# EAGLE design bluepod (EAGLE 9.5.2)
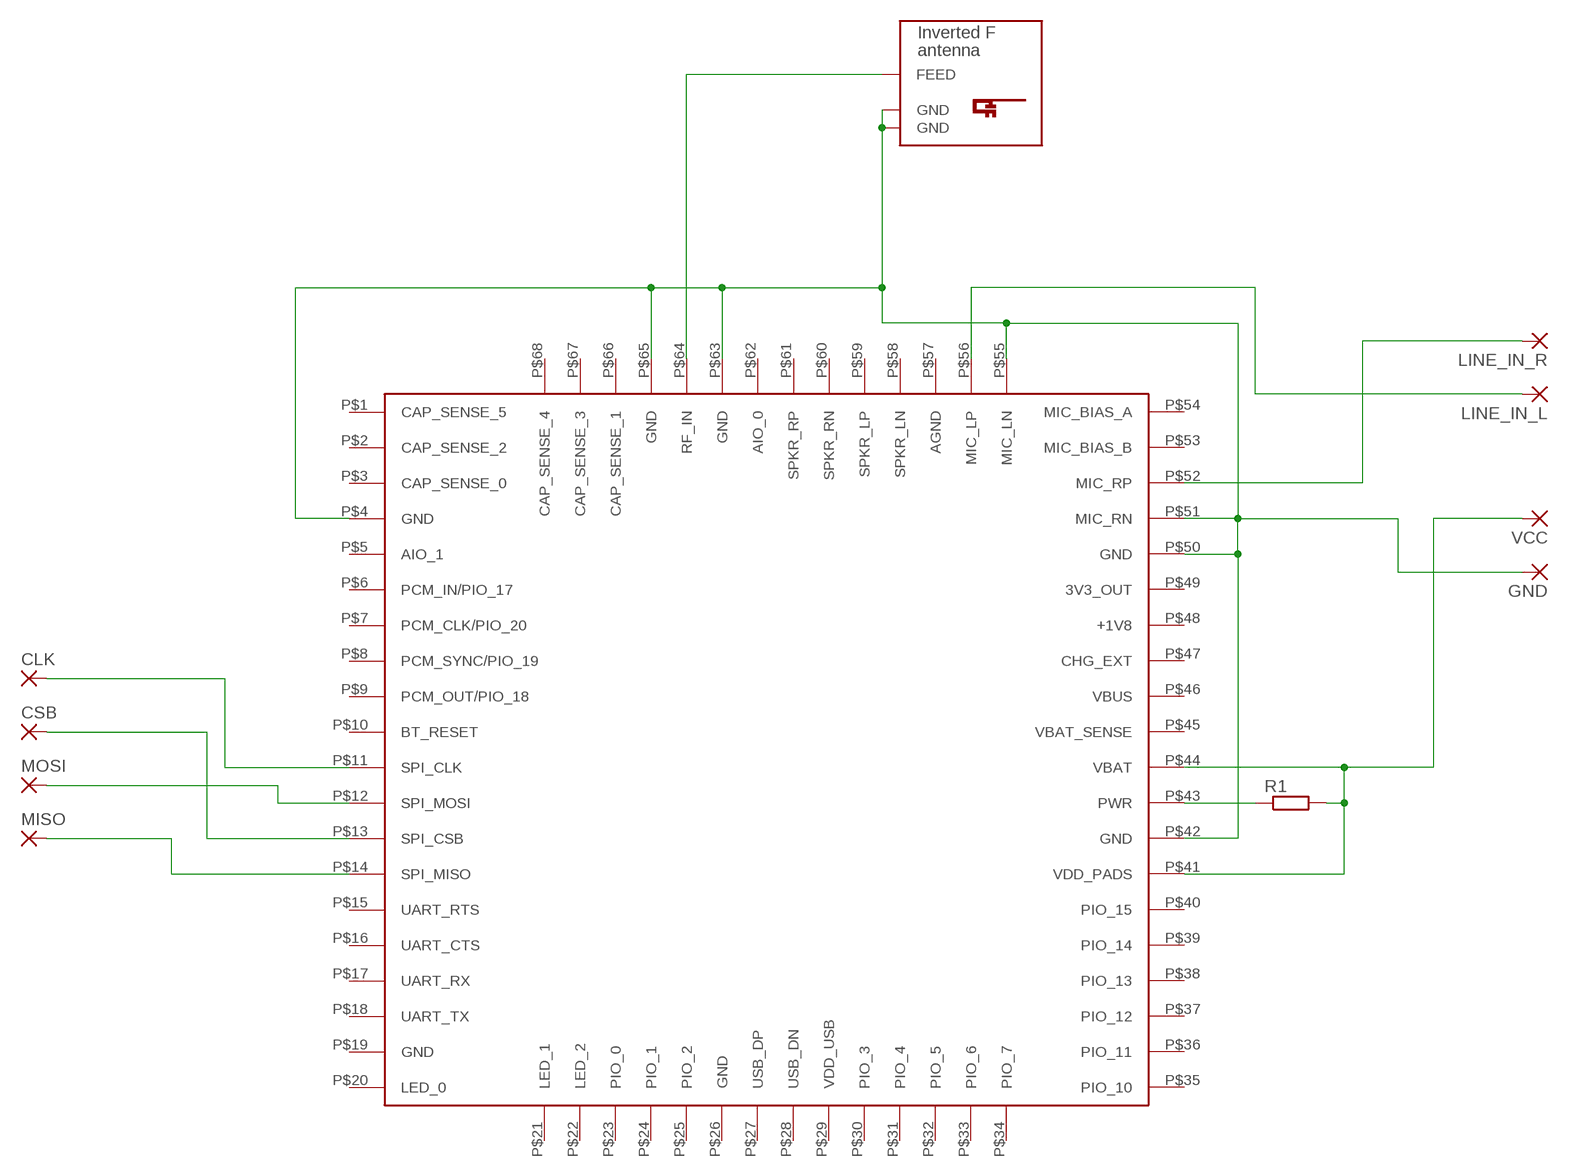
[diagram p0: schematic, sheet 1]

## Parts
CLK  2,54/1,0  [2,54/1,0]
CSB  2,54/1,0  [2,54/1,0]
GND  2,54/1,0  [2,54/1,0]
LINE_IN_L  2,54/1,0  [2,54/1,0]
LINE_IN_R  2,54/1,0  [2,54/1,0]
MISO  2,54/1,0  [2,54/1,0]
MOSI  2,54/1,0  [2,54/1,0]
R1  R-EU_0207/5V  [0207/5V]
U$1  BTM875-B  [STANDARD]
U$2  INVERTED_F_ANTENNA+0  [DN007+0]
VCC  2,54/1,0  [2,54/1,0]

## Nets
N$1: CLK.1(P) U$1.P$11(SPI_CLK)
N$2: CSB.1(P) U$1.P$13(SPI_CSB)
N$3: MOSI.1(P) U$1.P$12(SPI_MOSI)
N$4: MISO.1(P) U$1.P$14(SPI_MISO)
N$5: LINE_IN_R.1(P) U$1.P$52(MIC_RP)
N$6: LINE_IN_L.1(P) U$1.P$56(MIC_LP)
N$7: GND.1(P) U$1.P$4(GND) U$1.P$42(GND) U$1.P$50(GND) U$1.P$51(MIC_RN) U$1.P$55(MIC_LN) U$1.P$63(GND) U$1.P$65(GND) U$2.GND U$2.GND@1(GND)
N$8: U$1.P$64(RF_IN) U$2.FEED
N$9: R1.1 U$1.P$43(PWR)
N$11: R1.2 U$1.P$41(VDD_PADS) U$1.P$44(VBAT) VCC.1(P)
Unconnected: U$1.P$1(CAP_SENSE_5) U$1.P$2(CAP_SENSE_2) U$1.P$3(CAP_SENSE_0) U$1.P$5(AIO_1) U$1.P$6(PCM_IN/PIO_17) U$1.P$7(PCM_CLK/PIO_20) U$1.P$8(PCM_SYNC/PIO_19) U$1.P$9(PCM_OUT/PIO_18) U$1.P$10(BT_RESET) U$1.P$15(UART_RTS) U$1.P$16(UART_CTS) U$1.P$17(UART_RX) U$1.P$18(UART_TX) U$1.P$19(GND) U$1.P$20(LED_0) U$1.P$21(LED_1) U$1.P$22(LED_2) U$1.P$23(PIO_0) U$1.P$24(PIO_1) U$1.P$25(PIO_2) U$1.P$26(GND) U$1.P$27(USB_DP) U$1.P$28(USB_DN) U$1.P$29(VDD_USB) U$1.P$30(PIO_3) U$1.P$31(PIO_4) U$1.P$32(PIO_5) U$1.P$33(PIO_6) U$1.P$34(PIO_7) U$1.P$35(PIO_10) U$1.P$36(PIO_11) U$1.P$37(PIO_12) U$1.P$38(PIO_13) U$1.P$39(PIO_14) U$1.P$40(PIO_15) U$1.P$45(VBAT_SENSE) U$1.P$46(VBUS) U$1.P$47(CHG_EXT) U$1.P$48(+1V8) U$1.P$49(3V3_OUT) U$1.P$53(MIC_BIAS_B) U$1.P$54(MIC_BIAS_A) U$1.P$57(AGND) U$1.P$58(SPKR_LN) U$1.P$59(SPKR_LP) U$1.P$60(SPKR_RN) U$1.P$61(SPKR_RP) U$1.P$62(AIO_0) U$1.P$66(CAP_SENSE_1) U$1.P$67(CAP_SENSE_3) U$1.P$68(CAP_SENSE_4)

## Library data of the parts
CLK CSB GND LINE_IN_L LINE_IN_R MISO MOSI VCC = wirepad:2,54/1,0: THROUGH-HOLE PAD
R1 = rcl:R-EU_: RESISTOR, European symbol; SPICEPREFIX: R
U$1 = btm:BTM875-B
U$2 = antenna:INVERTED_F_ANTENNA: 2.4GHz Inverted F Antenna Based on TI Design Note DN007

## Board
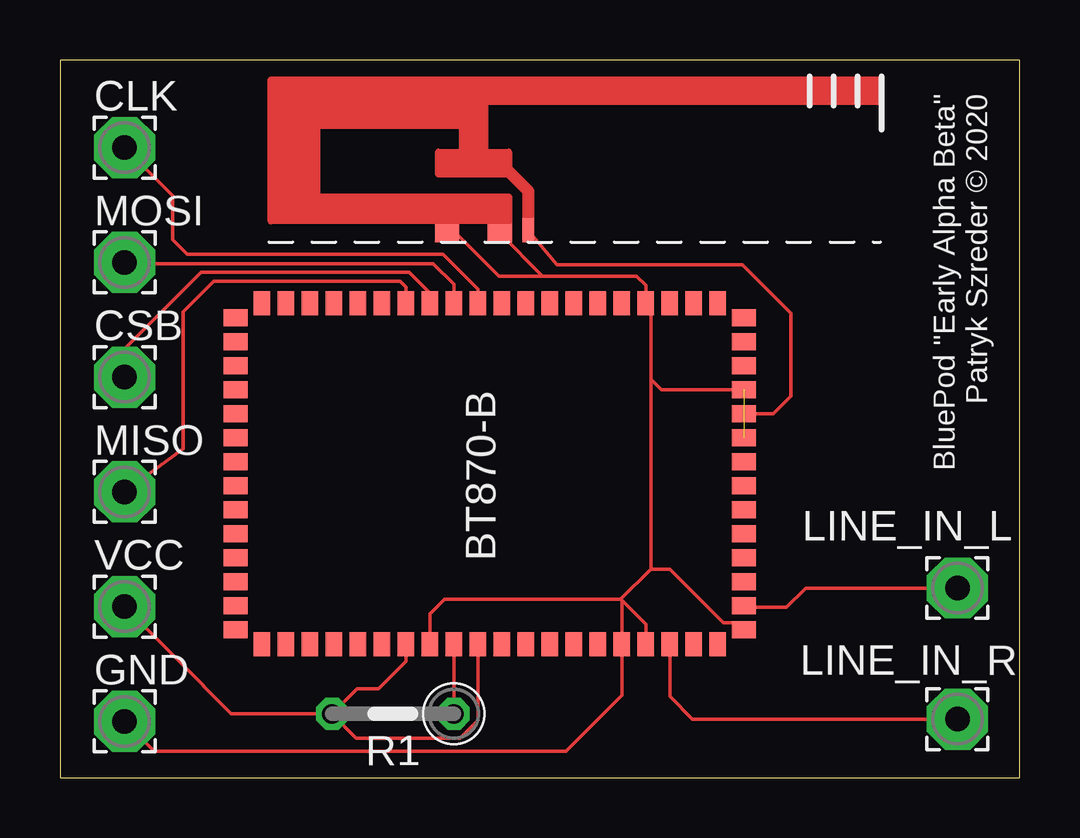
[diagram p1: board, top side]

Size 40 x 29.9 mm. Coordinates in mm from the lower left corner, seen from the top.
Outline: 0,0 40,0 40,29.9 0,29.9 0,0
Copper layers (1*16): Top 0.035mm / dielectric 1.5mm / Bottom 0.035mm
Design rules "default": minimum track width 6mil, minimum drill 0.35mm, track to track 6mil, track to pad 6mil, pad to pad 6mil, via to via 6mil, smd to smd 6mil, copper to edge 40mil, drill to drill 6mil, minimum pad ring 10mil, minimum via ring 8mil, stop-mask expansion 4mil, vias tented up to drill 0mil, thermal gap 10mil

### Footprints (pad centres in the part's own frame; a part is rotated, then mirrored left to right if it is on the bottom)
2,54/1,0 = drill 1.016 pad 2.54 octagon: 1 0,0
0207/5V = drill 0.813 octagon: 1 -2.54,0; 2 2.54,0
STANDARD = smd 1 x 0.7: P$1 -13.8,2.9; P$2 -13.8,1.9; P$3 -13.8,0.9; P$4 -13.8,-0.1; P$5 -13.8,-1.1; P$6 -13.8,-2.1; P$7 -13.8,-3.1; P$8 -13.8,-4.1; P$9 -13.8,-5.1; P$10 -13.8,-6.1; P$11 -13.8,-7.1; P$12 -13.8,-8.1; P$13 -13.8,-9.1; P$14 -13.8,-10.1; P$15 -13.8,-11.1; P$16 -13.8,-12.1; P$17 -13.8,-13.1; P$18 -13.8,-14.1; P$19 -13.8,-15.1; P$20 -13.8,-16.1; P$35 0.4,-16.1; P$36 0.4,-15.1; P$37 0.4,-14.1; P$38 0.4,-13.1; P$39 0.4,-12.1; P$40 0.4,-11.1; P$41 0.4,-10.1; P$42 0.4,-9.1; P$43 0.4,-8.1; P$44 0.4,-7.1; P$45 0.4,-6.1; P$46 0.4,-5.1; P$47 0.4,-4.1; P$48 0.4,-3.1; P$49 0.4,-2.1; P$50 0.4,-1.1; P$51 0.4,-0.1; P$52 0.4,0.9; P$53 0.4,1.9; P$54 0.4,2.9 | smd 0.7 x 1: P$21 -13.2,-17.2; P$22 -12.2,-17.2; P$23 -11.2,-17.2; P$24 -10.2,-17.2; P$25 -9.2,-17.2; P$26 -8.2,-17.2; P$27 -7.2,-17.2; P$28 -6.2,-17.2; P$29 -5.2,-17.2; P$30 -4.2,-17.2; P$31 -3.2,-17.2; P$32 -2.2,-17.2; P$33 -1.2,-17.2; P$34 -0.2,-17.2; P$55 -0.2,4; P$56 -1.2,4; P$57 -2.2,4; P$58 -3.2,4; P$59 -4.2,4; P$60 -5.2,4; P$61 -6.2,4; P$62 -7.2,4; P$63 -8.2,4; P$64 -9.2,4; P$65 -10.2,4; P$66 -11.2,4; P$67 -12.2,4; P$68 -13.2,4
DN007+0 = smd 0.46 x 1: FEED 2.22,-2.8 | smd 1.01 x 0.74: GND -1.16,-2.93; GND@1 1.035,-2.93

### Placement (x,y rotation side)
CLK  2.7,26.25 0 top
CSB  2.7,16.69 0 top
GND  2.7,2.34 0 top
LINE_IN_L  37.41,7.9 0 top
LINE_IN_R  37.41,2.44 0 top
MISO  2.7,11.9 0 top
MOSI  2.7,21.47 0 top
R1  13.88,2.66 180 top
U$1  24.52,5.96 270 top
U$2  17.3,25.61 0 top
VCC  2.7,7.12 0 top

### Tracks (layer width: path | path; a pad name or v marks a point on that pad's centre or on a via)
N$1
  Top 0.152: CLK.1 4.7,24.25 4.7,22.42 5.31,21.81 15.96,21.81 17.42,20.35 U$1.P$11
N$2
  Top 0.152: U$1.P$13 15.42,20.19 14.55,21.06 5.89,21.06 2.7,17.86 CSB.1
N$3
  Top 0.152: MOSI.1 2.84,21.46 2.88,21.41 15.56,21.41 16.42,20.55 16.42,20.03 16.42,19.93 U$1.P$12
N$4
  Top 0.152: MISO.1 5.13,13.69 5.13,19.41 6.41,20.68 14.17,20.68 14.42,20.43 U$1.P$14
N$5
  Top 0.152: LINE_IN_R.1 26.36,2.44 25.42,3.38 U$1.P$52
N$6
  Top 0.152: U$1.P$56 28.59,7.09 30.29,7.09 31.1,7.9 LINE_IN_L.1
N$7  (1 unrouted)
  Top 0.152: 24.63,16.6 24.63,19.52 U$1.P$4 24.42,20.51 24.03,20.9 20.12,20.9 | GND.1 3.93,1.11 21.09,1.11 23.42,3.44 U$1.P$50 23.42,7.38 | U$2.GND 16.52,22.68 18.3,20.9 20.12,20.9 | U$2.GND@1 20.12,20.9 | 24.63,16.6 25.07,16.16 U$1.P$65 | U$1.P$42 15.42,6.82 16.03,7.43 23.37,7.43 | 23.37,7.43 24.63,8.69 | 24.63,8.69 24.63,16.6 | 23.42,7.38 23.37,7.43 | U$1.P$51 24.42,6.38 23.42,7.38 | 24.63,8.69 25.43,8.69 27.66,6.46 28.22,6.46 U$1.P$55
N$8
  Top 0.152: U$2.FEED 20.73,21.37 28.44,21.37 30.47,19.34 30.47,15.89 29.74,15.16 U$1.P$64
N$9
  Top 0.152: R1.1 U$1.P$43
N$11
  Top 0.152: VCC.1 5.99,3.83 5.99,3.81 7.14,2.66 R1.2 | U$1.P$41 14.42,4.84 13.28,3.7 12.38,3.7 R1.2 | R1.2 12.35,1.65 16.68,1.65 17.42,2.39 U$1.P$44

### Text on the board
tNames: BluePod "Early Alpha Beta" / Patryk Szreder © 2020